# Altium schematic sheet peristaltic_pump.SchDoc
size A4
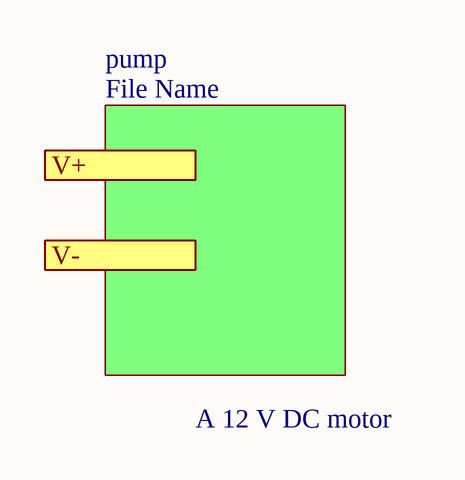
[diagram p0: peristaltic_pump.SchDoc]

## Sub-sheets
pump = File Name: no entries

## Ports
V+ (in), V- (out)

## Notes on the sheet
- A 12 V DC motor